# Altium schematic sheet 001_Revision History.SchDoc
size 420 x 297 mm; Page Create Date: May 29, 2006; WebSite: https://www.seeedstudio.com; Page Number: 1; Drawing: qxn; Schematic Name: BeaglePlay; Page Size: A3; Comment: Seeed Title; Page Count: 22; Page Name: 001_Revision History; Company: Seeed Studio; RevCode: v0.2; DsnPath: C:\Users\a0488739\Documents\GitHub\beagleplay\allegro\DVT\BEAGLEPLAYV020_220915.DSN; SchematicName: BeaglePlay; PageName: 001_Revision History; PageSize: A3; TopSchematic: True
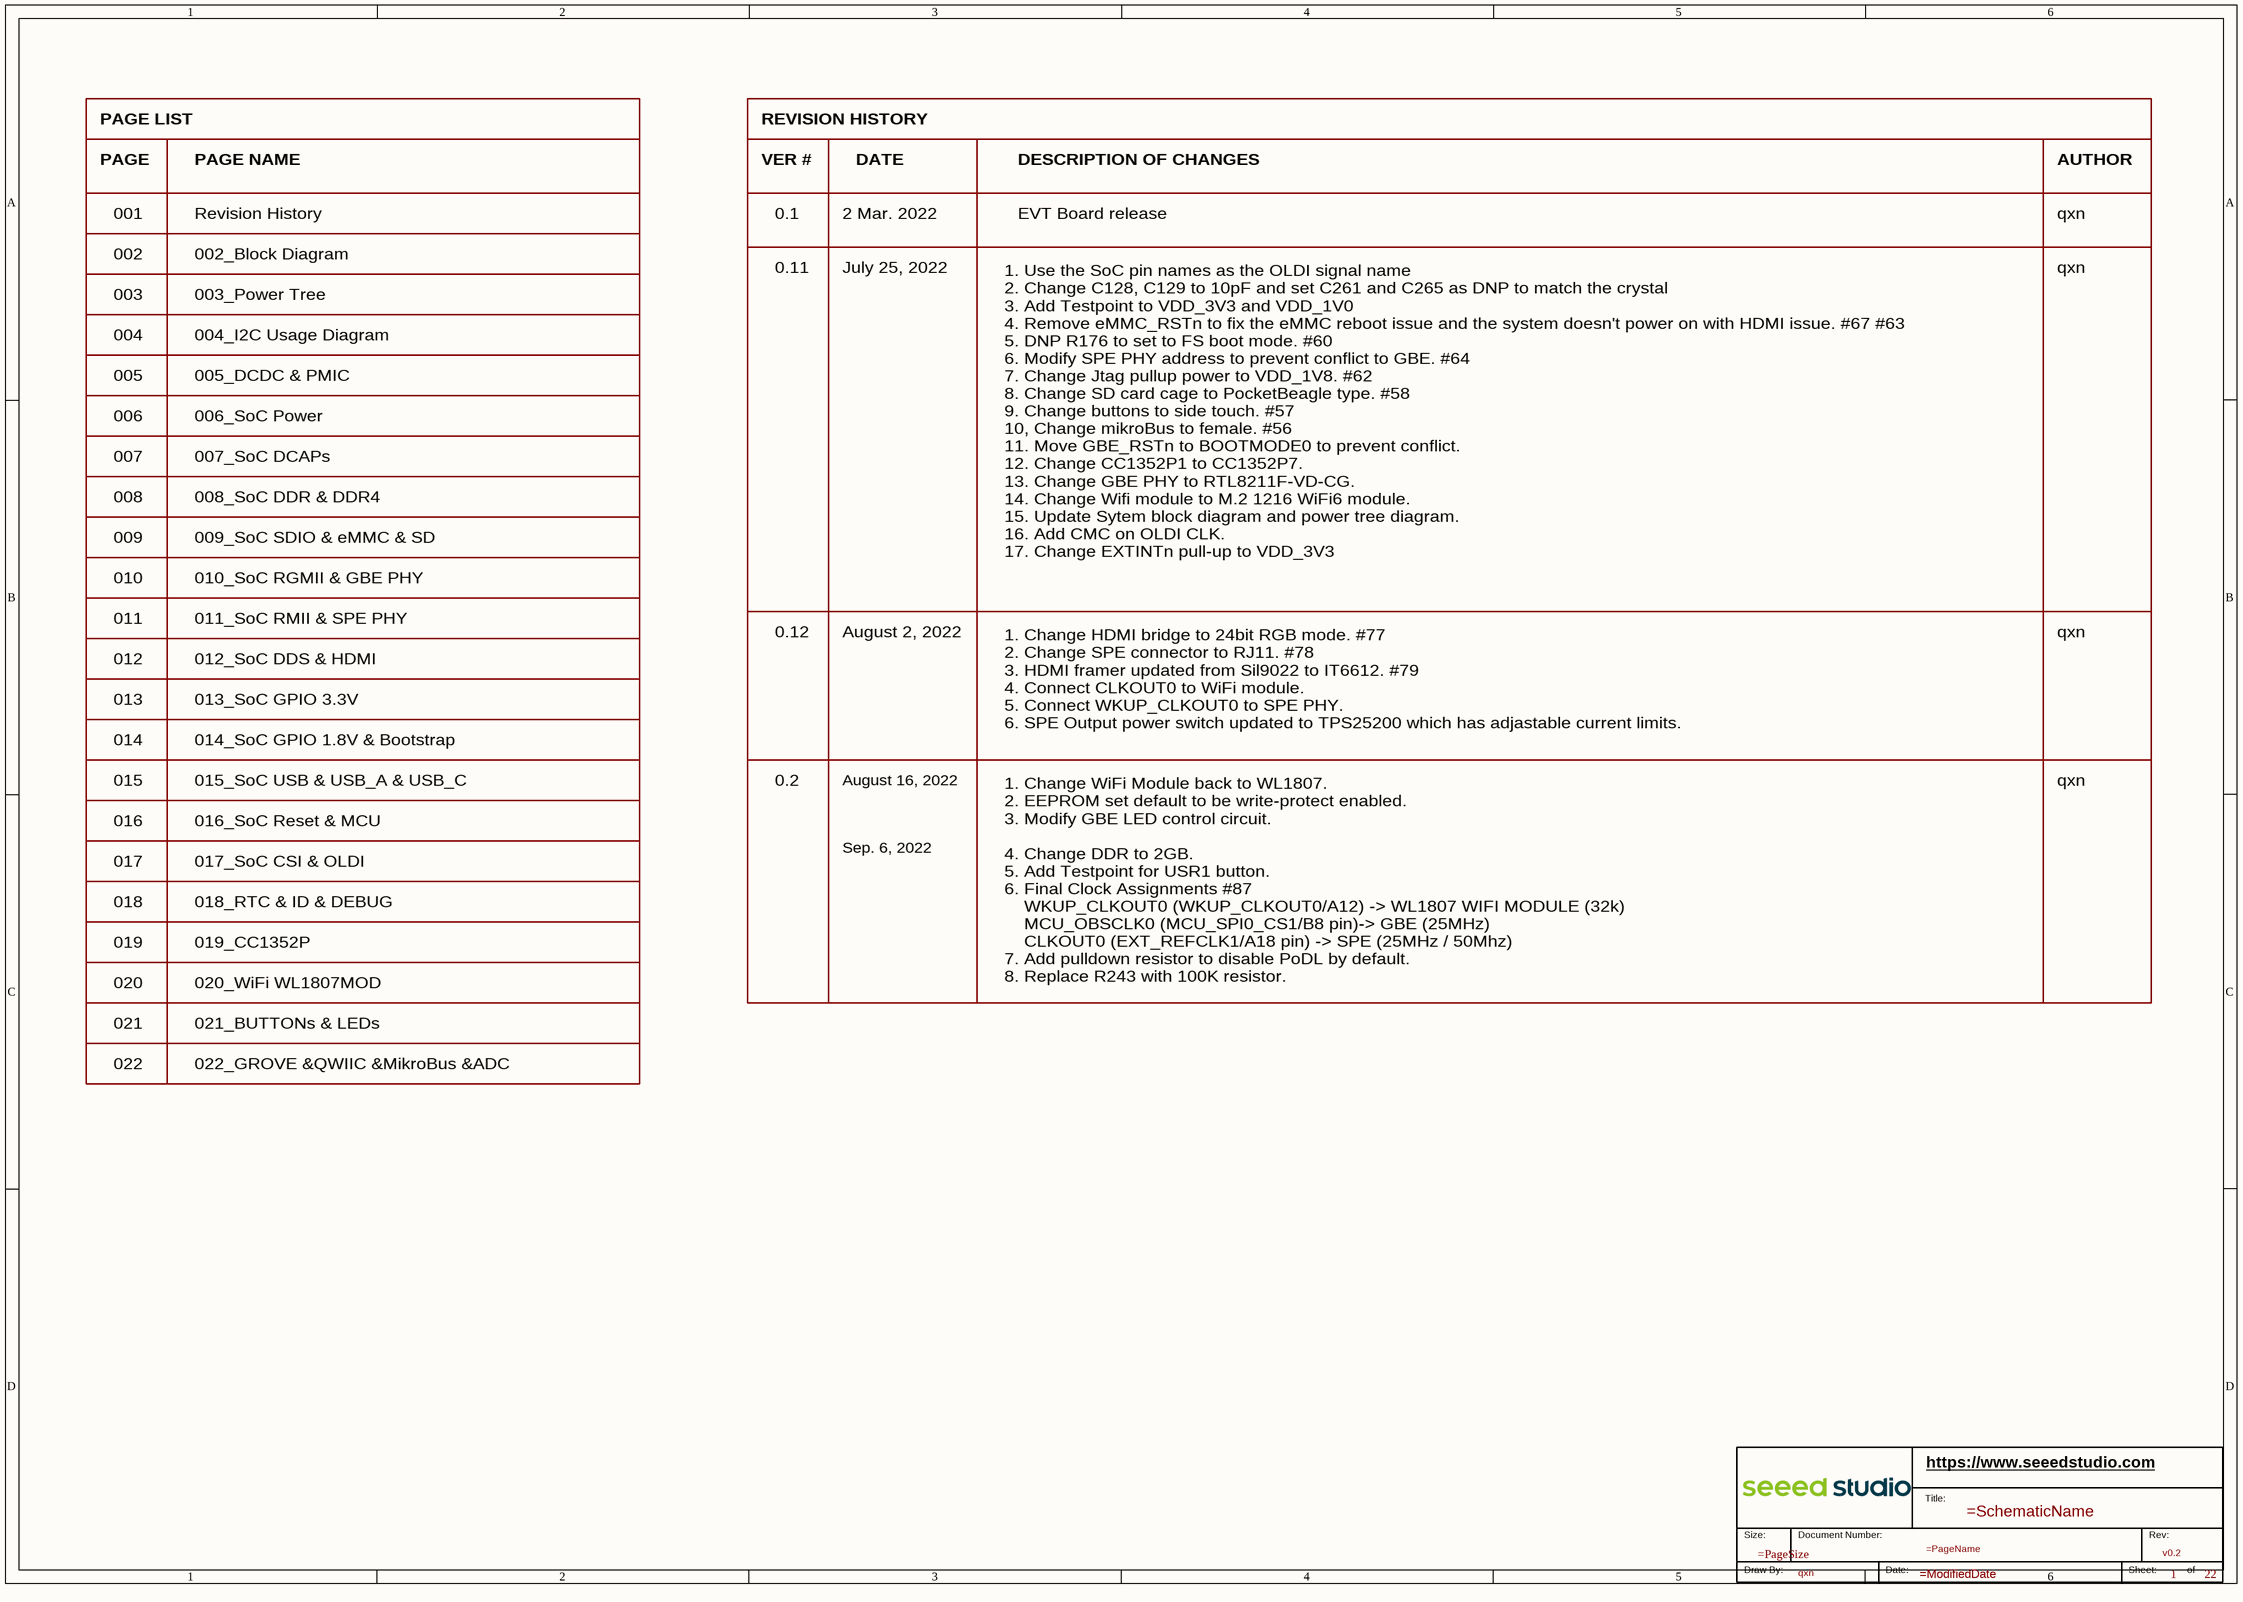
[diagram p0: 001_Revision History.SchDoc]

## Parts
*  RevCode: v0.2  Page Number: 1  Page Count: 22  Drawing: qxn  (hidden comment: Seeed Title)  (graphical)

## Notes on the sheet
- PAGE LIST
- REVISION HISTORY
- PAGE
- PAGE NAME
- VER #
- DATE
- DESCRIPTION OF CHANGES
- AUTHOR
- 001
- 002
- Revision History
- 002_Block Diagram
- 0.1
- 2 Mar. 2022
- 1. Use the SoC pin names as the OLDI signal name
  2. Change C128, C129 to 10pF and set C261 and C265 as DNP to match the crystal
  3. Add Testpoint to VDD_3V3 and VDD_1V0
  4. Remove eMMC_RSTn to fix the eMMC reboot issue and the system doesn't power on with HDMI issue. #67 #63
  5. DNP R176 to set to FS boot mode. #60
  6. Modify SPE PHY address to prevent conflict to GBE. #64
  7. Change Jtag pullup power to VDD_1V8. #62
  8. Change SD card cage to PocketBeagle type. #58
  9. Change buttons to side touch. #57
  10, Change mikroBus to female. #56
  11. Move GBE_RSTn to BOOTMODE0 to prevent conflict.
  12. Change CC1352P1 to CC1352P7.
  13. Change GBE PHY to RTL8211F-VD-CG.
  14. Change Wifi module to M.2 1216 WiFi6 module.
  15. Update Sytem block diagram and power tree diagram.
  16. Add CMC on OLDI CLK.
  17. Change EXTINTn pull-up to VDD_3V3
- EVT Board release
- qxn
- 003
- 003_Power Tree
- 0.11
- July 25, 2022
- 004
- 005
- 004_I2C Usage Diagram
- 005_DCDC & PMIC
- 006
- 007
- 006_SoC Power
- 007_SoC DCAPs
- 008
- 008_SoC DDR & DDR4
- 009
- 010
- 009_SoC SDIO & eMMC & SD
- 010_SoC RGMII & GBE PHY
- 011
- 012
- 011_SoC RMII & SPE PHY
- 012_SoC DDS & HDMI
- 0.12
- August 2, 2022
- 1. Change HDMI bridge to 24bit RGB mode. #77
  2. Change SPE connector to RJ11. #78
  3. HDMI framer updated from Sil9022 to IT6612. #79
  4. Connect CLKOUT0 to WiFi module.
  5. Connect WKUP_CLKOUT0 to SPE PHY.
  6. SPE Output power switch updated to TPS25200 which has adjastable current limits.
- 013
- 013_SoC GPIO 3.3V
- 014
- 015
- 015_SoC USB & USB_A & USB_C
- 014_SoC GPIO 1.8V & Bootstrap
- 0.2
- August 16, 2022
- 1. Change WiFi Module back to WL1807.
  2. EEPROM set default to be write-protect enabled.
  3. Modify GBE LED control circuit.
  4. Change DDR to 2GB.
  5. Add Testpoint for USR1 button.
  6. Final Clock Assignments #87
  WKUP_CLKOUT0 (WKUP_CLKOUT0/A12) -> WL1807 WIFI MODULE (32k)
  MCU_OBSCLK0 (MCU_SPI0_CS1/B8 pin)-> GBE (25MHz)
  CLKOUT0 (EXT_REFCLK1/A18 pin) -> SPE (25MHz / 50Mhz)
  7. Add pulldown resistor to disable PoDL by default.
  8. Replace R243 with 100K resistor.
- 016
- 017
- 016_SoC Reset & MCU
- 017_SoC CSI & OLDI
- Sep. 6, 2022
- 018
- 018_RTC & ID & DEBUG
- 020
- 019
- 020_WiFi WL1807MOD
- 019_CC1352P
- 022
- 021
- 021_BUTTONs & LEDs
- 022_GROVE &QWIIC &MikroBus &ADC
- (in symbol Seeed Title) https://www.seeedstudio.com; Title:; Size:; Document Number:; Rev:; Draw By:; Date:; Sheet:; of

## Library data of the parts
* = Seeed Title: Company: Seeed Studio; WebSite: https://www.seeedstudio.com; Schematic Name: =SchematicName; Page Size: =PageSize; Page Name: =PageName; Page Create Date: May 29, 2006; Page Modify Date: =ModifiedDate